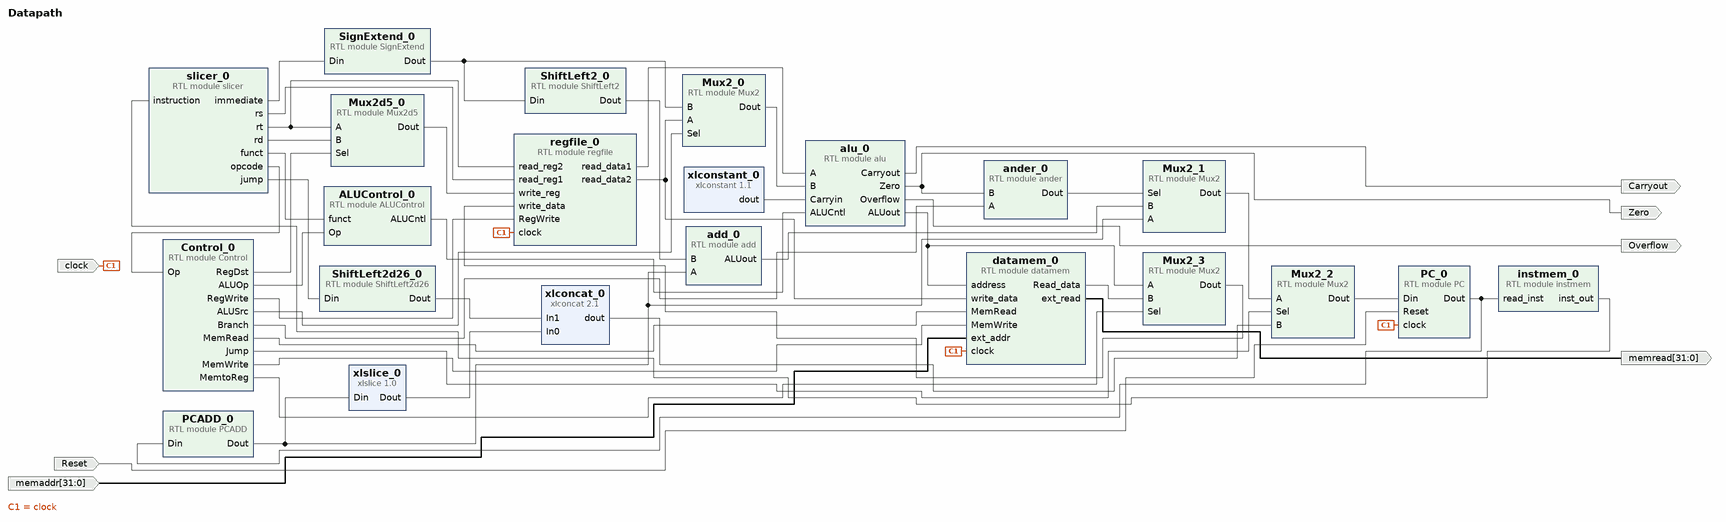
[diagram p0: block diagram of the top level]
# Vivado block design Datapath, xc7a35tcpg236-1, Vivado 2022.2
create_bd_design Datapath

create_bd_port -dir I Reset
create_bd_port -dir I -from 31 -to 0 memaddr
create_bd_port -dir O -from 31 -to 0 memread
create_bd_port -dir O Zero
create_bd_port -dir O Overflow
create_bd_port -dir O Carryout
create_bd_port -dir I clock

create_bd_cell -type module -reference PC PC_0
create_bd_cell -type module -reference Control Control_0
create_bd_cell -type module -reference PCADD PCADD_0
create_bd_cell -type module -reference Mux2d5 Mux2d5_0
create_bd_cell -type module -reference SignExtend SignExtend_0
create_bd_cell -type module -reference Mux2 Mux2_0
create_bd_cell -type ip -vlnv xilinx.com:ip:xlconstant:1.1 xlconstant_0
set_property -dict {CONFIG.CONST_VAL 0} [get_bd_cells xlconstant_0]
create_bd_cell -type module -reference ander ander_0
create_bd_cell -type module -reference ShiftLeft2d26 ShiftLeft2d26_0
create_bd_cell -type module -reference ShiftLeft2 ShiftLeft2_0
create_bd_cell -type module -reference add add_0
create_bd_cell -type ip -vlnv xilinx.com:ip:xlconcat:2.1 xlconcat_0
create_bd_cell -type ip -vlnv xilinx.com:ip:xlslice:1.0 xlslice_0
set_property -dict {CONFIG.DIN_FROM 31 CONFIG.DIN_TO 28} [get_bd_cells xlslice_0]
create_bd_cell -type module -reference Mux2 Mux2_1
create_bd_cell -type module -reference Mux2 Mux2_2
create_bd_cell -type module -reference Mux2 Mux2_3
create_bd_cell -type module -reference regfile regfile_0
create_bd_cell -type module -reference ALUControl ALUControl_0
create_bd_cell -type module -reference slicer slicer_0
create_bd_cell -type module -reference alu alu_0
create_bd_cell -type module -reference instmem instmem_0
create_bd_cell -type module -reference datamem datamem_0

# ---- connections ----

connect_bd_net [get_bd_pins ALUControl_0/ALUCntl] [get_bd_pins alu_0/ALUCntl]
connect_bd_net [get_bd_pins Control_0/ALUOp] [get_bd_pins ALUControl_0/Op]
connect_bd_net [get_bd_pins Control_0/ALUSrc] [get_bd_pins Mux2_0/Sel]
connect_bd_net [get_bd_pins Control_0/Branch] [get_bd_pins ander_0/A]
connect_bd_net [get_bd_pins Control_0/Jump] [get_bd_pins Mux2_2/Sel]
connect_bd_net [get_bd_pins Control_0/MemRead] [get_bd_pins datamem_0/MemRead]
connect_bd_net [get_bd_pins Control_0/MemWrite] [get_bd_pins datamem_0/MemWrite]
connect_bd_net [get_bd_pins Control_0/MemtoReg] [get_bd_pins Mux2_3/Sel]
connect_bd_net [get_bd_pins Control_0/RegDst] [get_bd_pins Mux2d5_0/Sel]
connect_bd_net [get_bd_pins Control_0/RegWrite] [get_bd_pins regfile_0/RegWrite]
connect_bd_net [get_bd_pins Mux2_0/Dout] [get_bd_pins alu_0/B]
connect_bd_net [get_bd_pins Mux2_1/Dout] [get_bd_pins Mux2_2/A]
connect_bd_net [get_bd_pins Mux2_2/Dout] [get_bd_pins PC_0/Din]
connect_bd_net [get_bd_pins Mux2_3/Dout] [get_bd_pins regfile_0/write_data]
connect_bd_net [get_bd_pins Mux2d5_0/Dout] [get_bd_pins regfile_0/write_reg]
connect_bd_net [get_bd_pins PCADD_0/Dout] [get_bd_pins xlslice_0/Din] [get_bd_pins Mux2_1/A] [get_bd_pins add_0/A]
connect_bd_net [get_bd_pins PC_0/Dout] [get_bd_pins PCADD_0/Din] [get_bd_pins instmem_0/read_inst]
connect_bd_net [get_bd_ports Reset] [get_bd_pins PC_0/Reset]
connect_bd_net [get_bd_pins ShiftLeft2_0/Dout] [get_bd_pins add_0/B]
connect_bd_net [get_bd_pins ShiftLeft2d26_0/Dout] [get_bd_pins xlconcat_0/In1]
connect_bd_net [get_bd_pins SignExtend_0/Dout] [get_bd_pins Mux2_0/B] [get_bd_pins ShiftLeft2_0/Din]
connect_bd_net [get_bd_pins add_0/ALUout] [get_bd_pins Mux2_1/B]
connect_bd_net [get_bd_pins alu_0/ALUout] [get_bd_pins Mux2_3/A] [get_bd_pins datamem_0/address]
connect_bd_net [get_bd_pins alu_0/Carryout] [get_bd_ports Carryout]
connect_bd_net [get_bd_pins alu_0/Overflow] [get_bd_ports Overflow]
connect_bd_net [get_bd_pins alu_0/Zero] [get_bd_ports Zero] [get_bd_pins ander_0/B]
connect_bd_net [get_bd_pins ander_0/Dout] [get_bd_pins Mux2_1/Sel]
connect_bd_net [get_bd_ports clock] [get_bd_pins PC_0/clock] [get_bd_pins regfile_0/clock] [get_bd_pins datamem_0/clock]
connect_bd_net [get_bd_pins datamem_0/Read_data] [get_bd_pins Mux2_3/B]
connect_bd_net [get_bd_pins datamem_0/ext_read] [get_bd_ports memread]
connect_bd_net [get_bd_pins instmem_0/inst_out] [get_bd_pins slicer_0/instruction]
connect_bd_net [get_bd_ports memaddr] [get_bd_pins datamem_0/ext_addr]
connect_bd_net [get_bd_pins regfile_0/read_data1] [get_bd_pins alu_0/A]
connect_bd_net [get_bd_pins regfile_0/read_data2] [get_bd_pins Mux2_0/A] [get_bd_pins datamem_0/write_data]
connect_bd_net [get_bd_pins slicer_0/funct] [get_bd_pins ALUControl_0/funct]
connect_bd_net [get_bd_pins slicer_0/immediate] [get_bd_pins SignExtend_0/Din]
connect_bd_net [get_bd_pins slicer_0/jump] [get_bd_pins ShiftLeft2d26_0/Din]
connect_bd_net [get_bd_pins slicer_0/opcode] [get_bd_pins Control_0/Op]
connect_bd_net [get_bd_pins slicer_0/rd] [get_bd_pins Mux2d5_0/B]
connect_bd_net [get_bd_pins slicer_0/rs] [get_bd_pins regfile_0/read_reg1]
connect_bd_net [get_bd_pins slicer_0/rt] [get_bd_pins Mux2d5_0/A] [get_bd_pins regfile_0/read_reg2]
connect_bd_net [get_bd_pins xlconcat_0/dout] [get_bd_pins Mux2_2/B]
connect_bd_net [get_bd_pins xlconstant_0/dout] [get_bd_pins alu_0/Carryin]
connect_bd_net [get_bd_pins xlslice_0/Dout] [get_bd_pins xlconcat_0/In0]

validate_bd_design
save_bd_design
